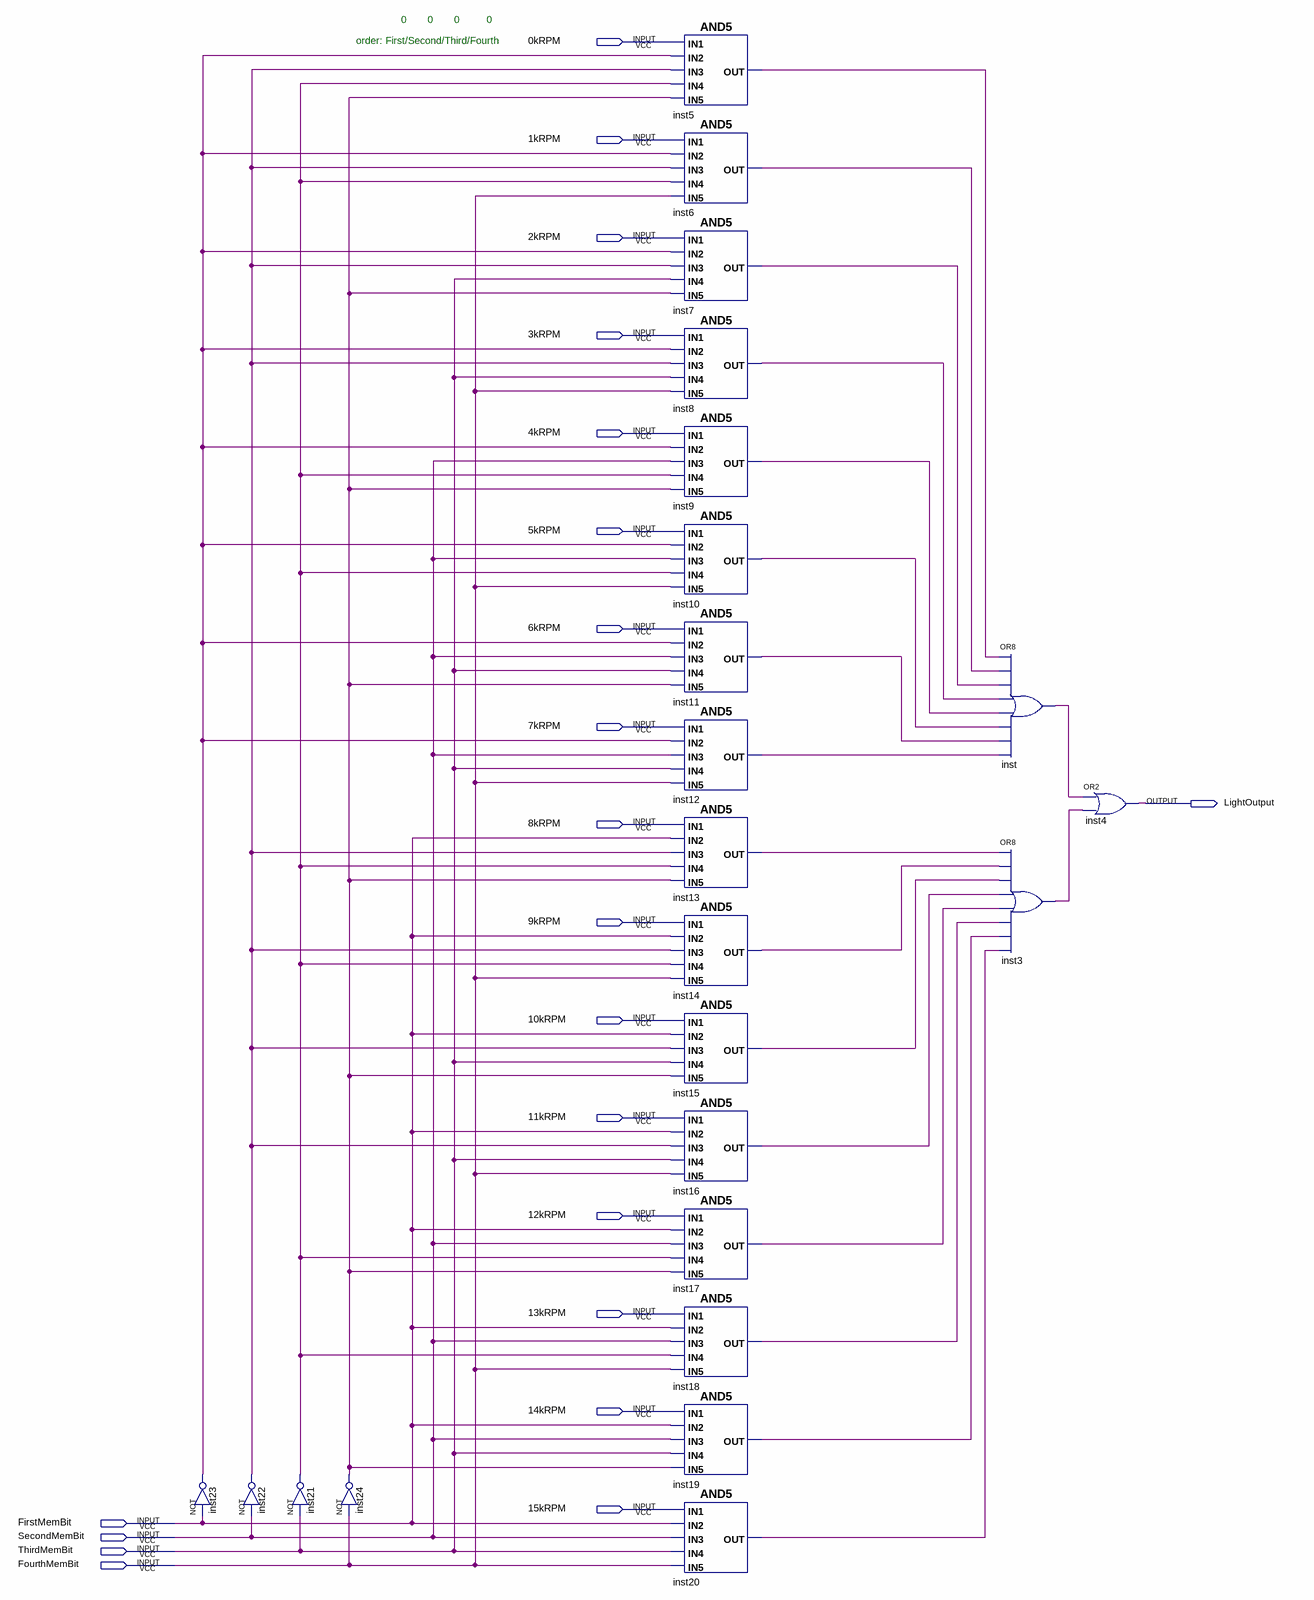
[diagram p0: schematic sheet]
// Quartus schematic EquationsToLight.bdf as structural Verilog: 23 symbols, 21 pins
module EquationsToLight (
  input  \0kRPM ,
  input  \1kRPM ,
  input  \2kRPM ,
  input  \3kRPM ,
  input  \4kRPM ,
  input  \5kRPM ,
  input  \6kRPM ,
  input  \7kRPM ,
  input  \8kRPM ,
  input  \9kRPM ,
  input  \10kRPM ,
  input  \11kRPM ,
  input  \12kRPM ,
  input  \13kRPM ,
  input  \14kRPM ,
  input  \15kRPM ,
  input  FirstMemBit,
  input  SecondMemBit,
  input  ThirdMemBit,
  input  FourthMemBit,
  output LightOutput
);

  wire inst3_out, inst5_out, inst6_out, inst7_out, inst8_out, inst9_out, inst10_out, inst11_out, inst12_out,
       inst13_out, inst14_out, inst15_out, inst16_out, inst17_out, inst18_out, inst19_out, inst20_out,
       inst21_out, inst22_out, inst23_out, inst24_out, inst_out;

  not inst23 (inst23_out, FirstMemBit);
  not inst22 (inst22_out, SecondMemBit);
  not inst21 (inst21_out, ThirdMemBit);
  not inst24 (inst24_out, FourthMemBit);
  and inst5 (inst5_out, \0kRPM , inst23_out, inst22_out, inst21_out, inst24_out);
  and inst6 (inst6_out, \1kRPM , inst23_out, inst22_out, inst21_out, FourthMemBit);
  and inst7 (inst7_out, \2kRPM , inst23_out, inst22_out, ThirdMemBit, inst24_out);
  and inst8 (inst8_out, \3kRPM , inst23_out, inst22_out, ThirdMemBit, FourthMemBit);
  and inst9 (inst9_out, \4kRPM , inst23_out, SecondMemBit, inst21_out, inst24_out);
  and inst10 (inst10_out, \5kRPM , inst23_out, SecondMemBit, inst21_out, FourthMemBit);
  and inst11 (inst11_out, \6kRPM , inst23_out, SecondMemBit, ThirdMemBit, inst24_out);
  and inst12 (inst12_out, \7kRPM , inst23_out, SecondMemBit, ThirdMemBit, FourthMemBit);
  and inst13 (inst13_out, \8kRPM , FirstMemBit, inst22_out, inst21_out, inst24_out);
  and inst14 (inst14_out, \9kRPM , FirstMemBit, inst22_out, inst21_out, FourthMemBit);
  and inst15 (inst15_out, \10kRPM , FirstMemBit, inst22_out, ThirdMemBit, inst24_out);
  and inst16 (inst16_out, \11kRPM , FirstMemBit, inst22_out, ThirdMemBit, FourthMemBit);
  and inst17 (inst17_out, \12kRPM , FirstMemBit, SecondMemBit, inst21_out, inst24_out);
  and inst18 (inst18_out, \13kRPM , FirstMemBit, SecondMemBit, inst21_out, FourthMemBit);
  and inst19 (inst19_out, \14kRPM , FirstMemBit, SecondMemBit, ThirdMemBit, inst24_out);
  and inst20 (inst20_out, \15kRPM , FirstMemBit, SecondMemBit, ThirdMemBit, FourthMemBit);
  or inst (inst_out, inst5_out, inst6_out, inst7_out, inst8_out, inst9_out, inst10_out, inst11_out, inst12_out);
  or inst3 (inst3_out, inst13_out, inst14_out, inst15_out, inst16_out, inst17_out, inst18_out, inst19_out, inst20_out);
  or inst4 (LightOutput, inst_out, inst3_out);

  // Notes on the sheet:
  //    0       0       0         0    
  //   order: First/Second/Third/Fourth
endmodule
